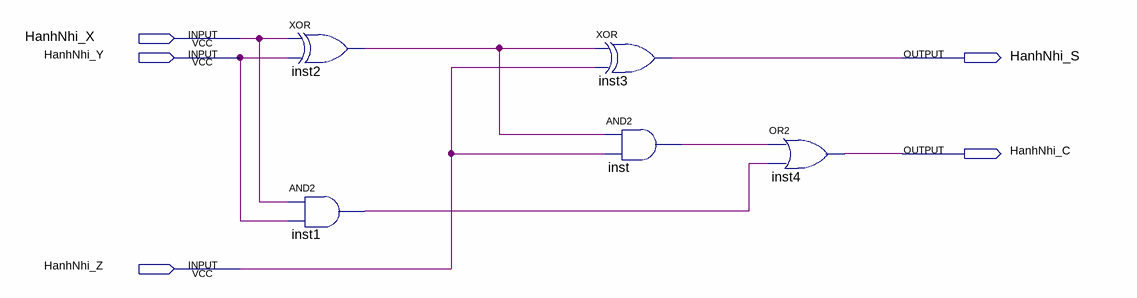
[diagram p0: schematic sheet]
// Quartus schematic full_adder.bdf as structural Verilog: 5 symbols, 5 pins
module full_adder (
  input  HanhNhi_X,
  input  HanhNhi_Y,
  input  HanhNhi_Z,
  output HanhNhi_S,
  output HanhNhi_C
);

  wire inst1_out, inst2_out, inst_out;

  xor inst2 (inst2_out, HanhNhi_X, HanhNhi_Y);
  and inst1 (inst1_out, HanhNhi_X, HanhNhi_Y);
  xor inst3 (HanhNhi_S, inst2_out, HanhNhi_Z);
  and inst (inst_out, inst2_out, HanhNhi_Z);
  or inst4 (HanhNhi_C, inst_out, inst1_out);
endmodule
